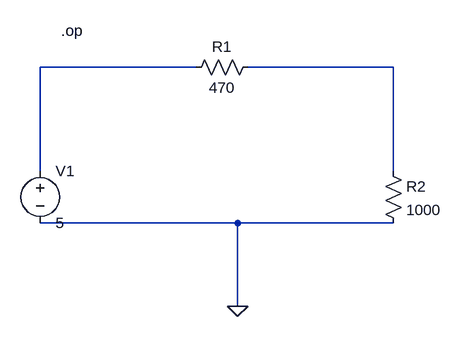
[diagram p0: schematic voltage-div.asc]
voltage-div.asc, the LTspice schematic file:
Version 4.1
SHEET 1 880 680
WIRE 304 -64 64 -64
WIRE 608 -64 384 -64
WIRE 64 96 64 -64
WIRE 608 96 608 -64
WIRE 368 176 64 176
WIRE 608 176 368 176
WIRE 368 304 368 176
FLAG 368 304 0
SYMBOL voltage 64 80 R0
WINDOW 123 0 0 Left 0
WINDOW 39 0 0 Left 0
SYMATTR InstName V1
SYMATTR Value 5
SYMBOL res 400 -80 R90
WINDOW 0 0 56 VBottom 2
WINDOW 3 32 56 VTop 2
SYMATTR InstName R1
SYMATTR Value 470
SYMBOL res 592 80 R0
SYMATTR InstName R2
SYMATTR Value 1000
TEXT 96 -120 Left 2 !.op

The netlist it stands for:
* voltage-div.asc
V1 N001 0 5
R1 N002 N001 470
R2 N002 0 1000
.op
.backanno
.end